# EAGLE design nokiaSuperBreakout (EAGLE 5.08)
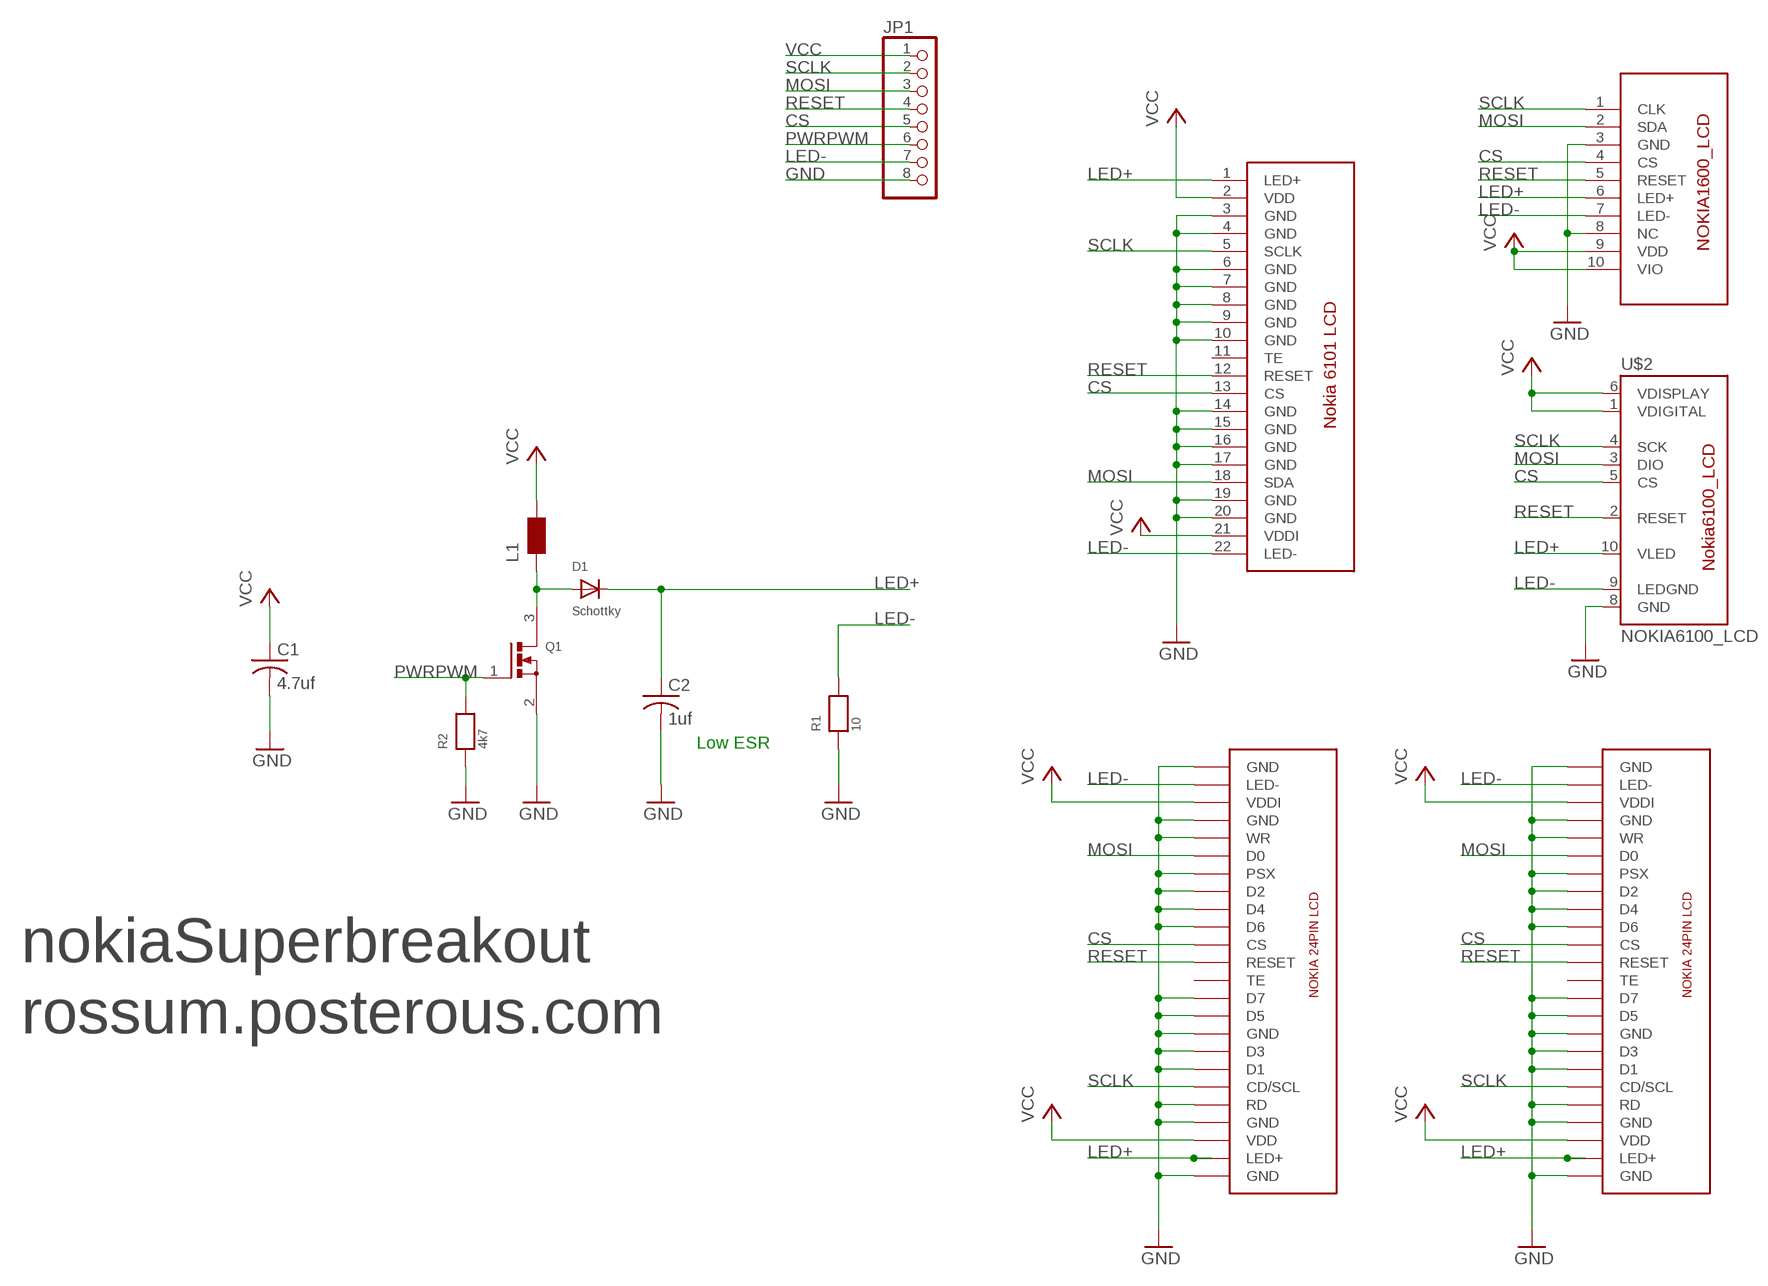
[diagram p0: schematic, sheet 1]

## Parts
C1  4.7uf  C-USC0805  [C0805]
C2  1uf  C-USC0805  [C0805]
D1  Schottky  DIODESOD-123  [SOD-123]
JP1  HEADER-1X8ROUND  [1X08_ROUND]
L1  WE-KIHQ_1008  [WE-KI_1008_B]
Q1  MOSFET-NREFLOW  [SOT23-R]
R1  10  RESISTOR0805  [0805]
R2  4k7  RESISTOR0805  [0805]
U$1  NOKIA1600_LCD  [NOKIA1600_LCD]
U$2  NOKIA6100_LCD  [NOKIA6100_LCD]
U$3  NOKIA6101_LCD  [NOKIA6101_LCD]
U$4  NOKIA24PIN_LCD  [FPC24_04MM]
U$5  NOKIA24PIN_LCD  [FPC24_04MM]

## Nets
CS: JP1.5 U$1.4(CS) U$2.5(CS) U$3.13(CS) U$4.P$11(CS) U$5.P$11(CS)
GND [power]: C1.2 C2.2 JP1.8 Q1.2(S) R1.1 R2.1 U$1.3(GND) U$1.8(NC) U$2.8(GND) U$3.3(GND) U$3.4(GND) U$3.6(GND) U$3.7(GND) U$3.8(GND) U$3.9(GND) U$3.10(GND) U$3.14(GND) U$3.15(GND) U$3.16(GND) U$3.17(GND) U$3.19(GND) U$3.20(GND) U$4.P$1(GND) U$4.P$4(GND) U$4.P$5(WR) U$4.P$7(PSX) U$4.P$8(D2) U$4.P$9(D4) U$4.P$10(D6) U$4.P$14(D7) U$4.P$15(D5) U$4.P$16(GND) U$4.P$17(D3) U$4.P$18(D1) U$4.P$20(RD) U$4.P$21(GND) U$4.P$24(GND) U$5.P$1(GND) U$5.P$4(GND) U$5.P$5(WR) U$5.P$7(PSX) U$5.P$8(D2) U$5.P$9(D4) U$5.P$10(D6) U$5.P$14(D7) U$5.P$15(D5) U$5.P$16(GND) U$5.P$17(D3) U$5.P$18(D1) U$5.P$20(RD) U$5.P$21(GND) U$5.P$24(GND)
LED+ [power]: C2.1 D1.C U$1.6(LED+) U$2.10(VLED) U$3.1(LED+) U$4.P$23(LED+) U$5.P$23(LED+)
LED-: JP1.7 R1.2 U$1.7(LED-) U$2.9(LEDGND) U$3.22(LED-) U$4.P$2(LED-) U$5.P$2(LED-)
MOSI: JP1.3 U$1.2(SDA) U$2.3(DIO) U$3.18(SDA) U$4.P$6(D0) U$5.P$6(D0)
N$6: D1.A L1.2 Q1.3(D)
PWRPWM: JP1.6 Q1.1(G) R2.2
RESET: JP1.4 U$1.5(RESET) U$2.2(RESET) U$3.12(RESET) U$4.P$12(RESET) U$5.P$12(RESET)
SCLK: JP1.2 U$1.1(CLK) U$2.4(SCK) U$3.5(SCLK) U$4.P$19(CD/SCL) U$5.P$19(CD/SCL)
VCC [power]: C1.1 JP1.1 L1.1 U$1.9(VDD) U$1.10(VIO) U$2.1(VDIGITAL) U$2.6(VDISPLAY) U$3.2(VDD) U$3.21(VDDI) U$4.P$3(VDDI) U$4.P$22(VDD) U$5.P$3(VDDI) U$5.P$22(VDD)
Unconnected: U$3.11(TE) U$4.P$13(TE) U$5.P$13(TE)

## Notes on the sheet
- Low ESR
- nokiaSuperbreakout
- rossum.posterous.com

## Library data of the parts
C1 C2 = adafruit:C-US: CAPACITOR, American symbol
D1 = microbuilder:DIODE: Diode SMADIODE - SMA Surface Mount Package 20V 1A Schottky Diode Digikey: 641-1014-6-ND SOD-123 30V 500mA (430mV Vf) Schottky Diode - Digikey: B0530W-FDICT-ND SOD-323 10V 570mA (380mV Vf, 3ns) Schottky Diode - Digikey: ZLLS410CT-ND SOD-523 30V 30mA Schottky Diode (RB751S-40TE61) - Digikey: RB751S-40TE61CT-ND SOT23-R/W - SOT23 Package (R = Solder Paste/Reflow Ovens, W = Hand-Soldering) BAT54Film 40V 300mA - Digikey: 497-7162-1-ND DO-1N4148 Through Hole Small Current Diode (any model)
JP1 = microbuilder:HEADER-1X8: PIN HEADER
L1 = PeterAtMega644:WE-KIHQ: SMD Wire Wound Ceramic Inductor WE-KIHQ - High current - Highest Quality factor in size 0805 - up to 98 - High thermal stability - High SRF -- Bluetooth -- Wireless LAN -- RF oscillation circuit -- IF impedance matching -- IG choke
Q1 = microbuilder:MOSFET-N: N-Channel Mosfet Digikey: 2N7002ET1GOSTR-ND
R1 R2 = microbuilder:RESISTOR: Resistors 0603 - 0603 Surface Mount Package 0 Ohm 1/10 Watt 1% Resistor 15 Ohm 1/10 Watt 1% Resistor 33 Ohm 1/10 Watt 1% Resistor 49.9 Ohm 1/10 Watt 1% Resistor 100 Ohm 1/10 Watt 1% Resistor 150 Ohm 1/10 Watt 1% Resistor 240 Ohm 1/10 Watt 1% Resistor 390 Ohm 1/10 Watt 1% Resistor 560 Ohm 1/10 Watt 1% Resistor 750 Ohm 1/10 Watt 1% Resistor 1.0K Ohm 1/10 Watt 1% Resistor 1.5K Ohm 1/10 Watt 1% Resistor 2.0K Ohm 1/10 Watt 1% Resistor 10.0K Ohm 1/10 Watt 1% Resistor 20.0K Ohm 1/10 Watt 1% Resistor 33.0K Ohm 1/10 Watt 1% Resistor 100.0K Ohm 1/10 Watt 1% Resistor 0805 - 0805 Surface Mount Package 0 Ohm 1/8 Watt 1% Resistor 33 Ohm 1/8 Watt 1% Resistor 100 Ohm 1/8 Watt 1% Resistor 150 Ohm 1/8 Watt 1% Resistor 200 Ohm 1/8 Watt 1% Resistor 240 Ohm 1/8 Watt 1% Resistor 330 Ohm 1/8 Watt 1% Resistor 390 Ohm 1/8 Watt 1% Resistor 470 Ohm 1/8 Watt 1% Resistor 1.0K Ohm 1/8 Watt 1% Resistor 1.5K Ohm 1/8 Watt 1% Resistor 2.0K Ohm 1/8 Watt 1% Resistor 4.7K Ohm 1/8 Watt 1% Resistor 5.1K Ohm 1/8 Watt 1% Resistor 5.6K Ohm 1/8 Watt 1% Resistor 10.0K Ohm 1/8 Watt 1% Resistor 22.0K Ohm 1/8 Watt 1% Resistor 33.0K Ohm 1/8 Watt 1% Resistor 100K Ohm 1/8 Watt 1% Resistor 1206 - 1206 Surface Mount Package
U$1 = PeterAtMega644:NOKIA1600_LCD
U$2 = PeterAtMega644:NOKIA6100_LCD: Nokia 6100 Color LCD Schematic element and footprint production proven but could use some touching up. Spark Fun Electronics SKU : LCD-00569. Mating SMD connector : LCD-00570
U$3 = PeterAtMega644:NOKIA6101_LCD: Serial Config for Nokia 6100 Display
U$4 U$5 = PeterAtMega644:NOKIA24PIN_LCD: 24 Pin Nokia Display as found in 3110/2630 etc

## Net classes
0 default: width 0.203 mm, drill 0.305 mm, clearance 0.152 mm
1 power: width 0.203 mm, drill 0.305 mm, clearance 0.152 mm

## Board
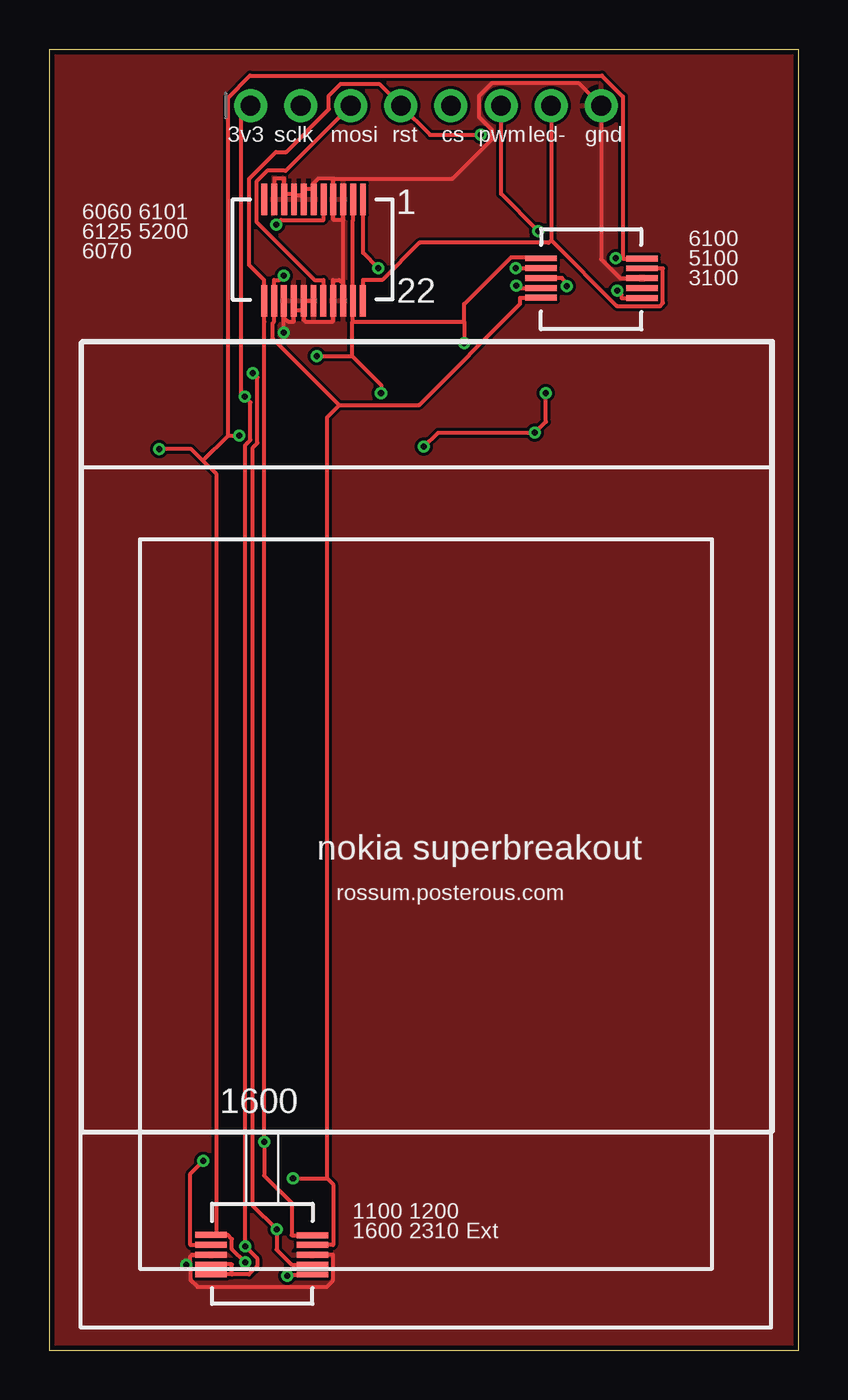
[diagram p1: board, top side]
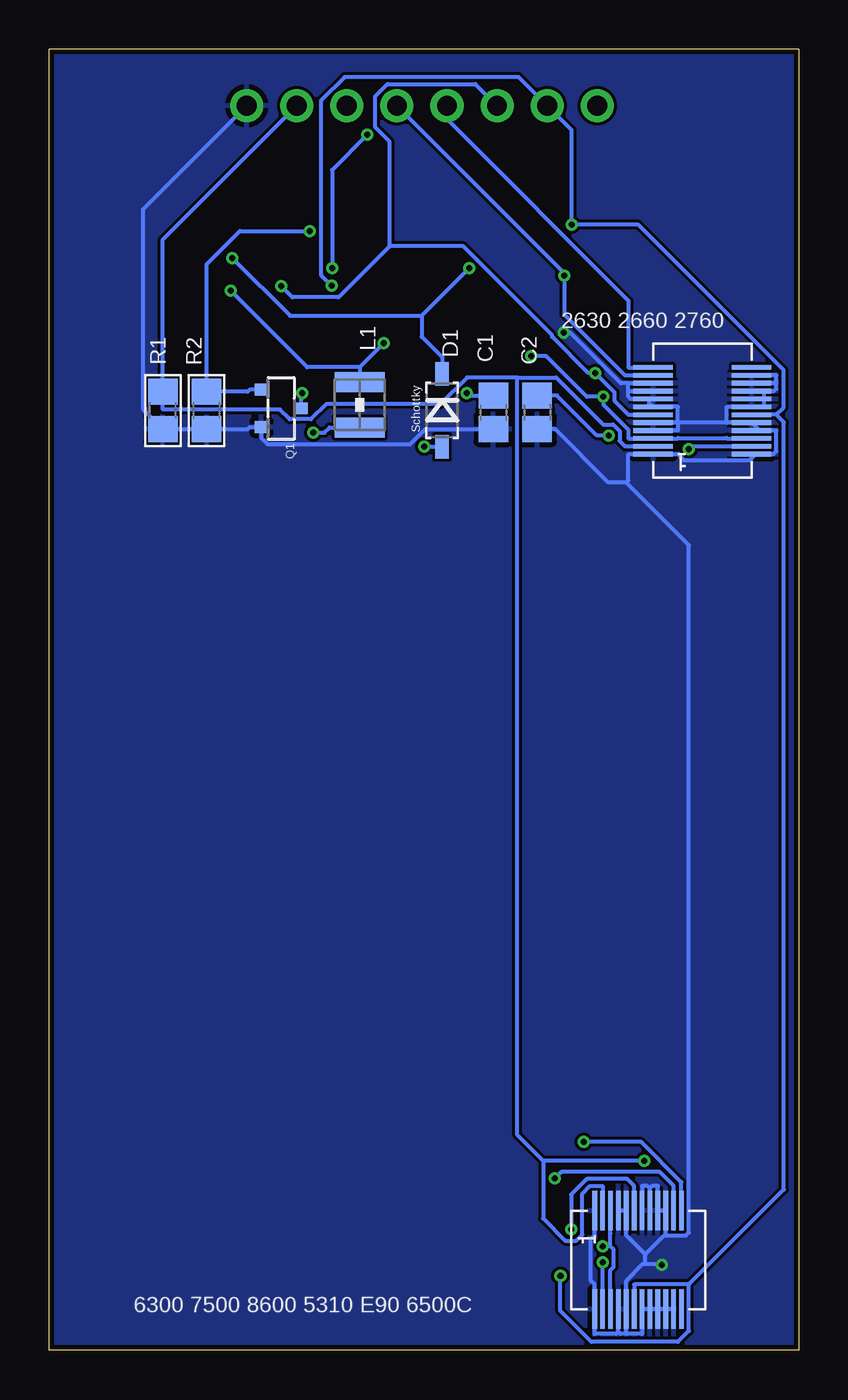
[diagram p2: board, bottom side, seen from below]

Size 38 x 66 mm. Coordinates in mm from the lower left corner, seen from the top.
Outline: 0,0 38,0 38,66 0,66 0,0
Copper layers (1*16): Top 0.035mm / dielectric 1.5mm / Bottom 0.035mm
Design rules "Fusion_eagle_rule_v1.1": minimum track width 6mil, minimum drill 12mil, track to track 6mil, track to pad 6mil, pad to pad 6mil, via to via 6mil, smd to smd 0mil, copper to edge 10mil, drill to drill 10mil, minimum pad ring 10mil, minimum via ring 6mil, stop-mask expansion 2mil, vias tented up to drill 100mil, thermal gap 10mil

### Footprints (pad centres in the part's own frame; a part is rotated, then mirrored left to right if it is on the bottom)
C0805 = smd 1.3 x 1.5: 1 -0.85,0; 2 0.85,0
SOD-123 = smd 1.2 x 0.7: A 1.85,0; C -1.85,0
1X08_ROUND = drill 1 pad 1.676 round: 1 -8.89,0; 2 -6.35,0; 3 -3.81,0; 4 -1.27,0; 5 1.27,0; 6 3.81,0; 7 6.35,0; 8 8.89,0
WE-KI_1008_B = smd 1.02 x 2.54: 1 -1.145,0; 2 1.145,0
SOT23-R = smd 0.6 x 0.7: 1 -0.95,-1; 2 0.95,-1; 3 0,1
0805 = smd 1.3 x 1.5: 1 -0.95,0; 2 0.95,0
NOKIA1600_LCD = smd 1.6 x 0.3: 1 23.255,40.961; 2 23.255,40.461; 3 23.255,39.961; 4 23.255,39.461; 5 23.255,38.961; 6 28.389,38.953; 7 28.389,39.453; 8 28.389,39.953; 9 28.389,40.453; 10 28.389,40.953
NOKIA6100_LCD = smd 1.6 x 0.3: 1 23.255,44.311; 2 23.255,43.811; 3 23.255,43.311; 4 23.255,42.811; 5 23.255,42.311; 6 28.389,42.303; 7 28.389,42.803; 8 28.389,43.303; 9 28.389,43.803; 10 28.389,44.303
NOKIA6101_LCD = smd 0.3 x 1.6: 1 14.311,57.245; 2 13.811,57.245; 3 13.311,57.245; 4 12.811,57.245; 5 12.311,57.245; 6 11.811,57.245; 7 11.311,57.245; 8 10.811,57.245; 9 10.311,57.245; 10 9.811,57.245; 11 9.311,57.245; 12 9.3,52.1; 13 9.8,52.1; 14 10.3,52.1; 15 10.8,52.1; 16 11.3,52.1; 17 11.8,52.1; 18 12.3,52.1; 19 12.8,52.1; 20 13.3,52.1; 21 13.8,52.1; 22 14.3,52.1
FPC24_04MM = smd 2 x 0.24: P$1 2.6,2; P$2 2.6,1.6; P$3 2.6,1.2; P$4 2.6,0.8; P$5 2.6,0.4; P$6 2.6,0; P$7 2.6,-0.4; P$8 2.6,-0.8; P$9 2.6,-1.2; P$10 2.6,-1.6; P$11 2.6,-2; P$12 2.6,-2.4; P$13 -2.4,-2.4; P$14 -2.4,-2; P$15 -2.4,-1.6; P$16 -2.4,-1.2; P$17 -2.4,-0.8; P$18 -2.4,-0.4; P$19 -2.4,0; P$20 -2.4,0.4; P$21 -2.4,0.8; P$22 -2.4,1.2; P$23 -2.4,1.6; P$24 -2.4,2

### Placement (x,y rotation side)
C1  15.48,47.58 270 bottom
C2  13.26,47.58 270 bottom
D1  18.08,47.68 270 bottom
JP1  19.1,63.14 0 top
L1  22.26,47.96 270 bottom
Q1  26.24,47.78 270 bottom
R1  32.24,47.68 90 bottom
R2  30.02,47.68 90 bottom
U$1  36.6,44.8 180 top
U$2  1.68,11.08 0 top
U$3  1.6,1.14 0 top
U$4  8.34,4.48 90 bottom
U$5  4.78,47.46 180 bottom

### Tracks (layer width: path | path; a pad name or v marks a point on that pad's centre or on a via)
CS  (via drill 0.3 pad 0.61)
  Top 0.203: v12.36,8.72 14.1,8.72 | 14.1,8.72 14.4,8.42 14.4,5.34 U$1.4 | 14.1,8.72 14.1,47.34 14.71,47.96 | 14.71,47.96 18.75,47.96 23.88,53.09 23.88,53.39 U$2.5 | 14.71,47.96 11.34,51.33 11.34,52.13 11.4,52.19 U$3.13 11.4,53.77 11.4,54.29 11.66,54.29 v11.88,54.51
  Bottom 0.203: U$4.P$11 6.34,8.33 7.05,9.05 12.03,9.05 v12.36,8.72 | JP1.5 11.88,54.65 v11.88,54.51 11.88,52.53 8.81,49.46 U$5.P$11
GND  (via drill 0.3 pad 0.61)
  Top 0.203: v6.95,4.34 7.16,4.34 | 7.16,4.34 7.16,3.58 7.52,3.22 14.07,3.22 14.4,3.55 14.4,4.84 U$1.3 | 7.16,4.34 7.16,4.76 7.25,4.85 U$1.8 | 14.41,59.44 20.45,59.44 22.46,61.44 22.46,61.9 21.82,62.54 21.82,63.65 22.46,64.3 26.84,64.3 JP1.8 27.99,55.35 28.96,54.38 29.02,54.38 U$2.8 | 12.9,52.76 12.9,52.27 12.99,52.19 14.4,52.19 U$3.19 14.4,54.29 14.7,54.29 14.9,54.1 | 12.9,52.76 U$3.16 U$3.17 | 12.4,52.76 12.4,52.19 12.1,52.19 11.9,52.38 | 12.4,52.76 U$3.15 | 12.4,52.76 12.9,52.76 | 11.9,52.38 11.9,53.02 U$3.14 | v11.9,51.61 11.9,52.19 11.9,52.38 | 14.9,54.1 14.9,53.5 U$3.20 | 14.9,57.33 14.41,57.33 U$3.4 14.41,59.35 14.41,59.44 | 14.9,57.33 14.91,57.33 U$3.3 | 14.9,57.33 14.9,54.29 14.9,54.1 | 12.41,58.58 12.35,58.65 11.91,58.65 | 12.41,58.58 12.41,58.52 U$3.8 | 12.91,58.58 12.91,58.91 13.41,58.91 | 12.91,58.58 U$3.7 | 12.91,58.58 12.41,58.58 | 14.41,59.44 13.65,59.44 13.41,59.2 13.41,58.91 | 13.41,58.91 U$3.6 | 11.91,58.65 11.91,58.91 11.91,59.24 11.91,59.44 11.41,59.44 U$3.10 | 11.91,58.65 U$3.9
  Bottom 0.203: 7.78,4.38 6.98,4.38 v6.95,4.34 | 7.78,4.38 7.89,4.38 8.74,3.53 U$4.P$20 8.74,0.83 | 7.78,4.38 7.78,4.86 | 7.78,4.86 8.74,5.83 U$4.P$5 U$4.P$4 | 6.74,5.83 | 6.74,5.83 6.81,5.83 7.78,4.86 | 8.75,44.03 5.57,40.84 5.57,5.97 5.71,5.83 6.74,5.83 | 2.18,45.46 2.48,45.16 5.82,45.16 6.13,45.46 U$5.P$1 8.63,45.46 8.63,44.14 8.75,44.03 | 7.58,48.26 7.58,48.06 U$5.P$7 6.13,47.86 6.13,47.06 | 7.58,48.26 8.01,48.26 8.52,48.26 8.63,48.38 8.63,48.66 | 8.63,48.66 U$5.P$9 | 7.58,48.26 U$5.P$8 | 6.13,47.06 6.98,47.06 U$5.P$5 | 6.13,47.06 6.13,46.66 U$5.P$4 | 3.63,47.06 6.13,47.06 | 1.98,46.66 U$5.P$20 3.63,47.06 | 1.98,46.66 U$5.P$21 | 1.98,46.66 1.75,46.66 1.13,46.66 1.13,45.61 1.28,45.46 2.18,45.46 | C1.2 18.93,46.73 19.7,45.96 26.93,45.96 27.24,46.28 Q1.2 27.54,46.83 27.84,46.83 27.94,46.73 R2.1 31.02,46.73 R1.1 33.26,47.75 33.26,57.87 JP1.8 | v11.9,51.61 11.57,51.61 9.02,49.06 8.63,49.06 | 8.74,0.83 7.94,0.83 U$4.P$18 U$4.P$17 U$4.P$16 U$4.P$15 U$4.P$14 | 9.14,0.94 9.02,0.83 8.74,0.83 | U$4.P$21 9.14,1.77 9.14,1.45 9.14,0.94 | 3.63,47.06 3.63,47.86 U$5.P$18 2.07,47.86 1.75,47.86 1.75,48.26 | U$4.P$1 10.34,5.83 10.54,5.63 10.54,3.53 10.34,3.33 U$4.P$24 10.34,0.83 9.26,0.83 9.14,0.94 | 8.75,44.03 9.64,44.03 12.35,46.73 C2.2 | 7.54,8.21 7.42,8.33 7.14,8.33 U$4.P$9 U$4.P$10 6.74,5.83 | 7.54,8.21 7.66,8.33 7.94,8.33 U$4.P$7 | 7.54,8.21 7.54,7.71 U$4.P$8 | 8.63,48.66 8.63,49.06 | 8.63,49.06 U$5.P$10 | 2.18,45.46 U$5.P$24 | U$5.P$17 2.07,48.26 1.75,48.26 | 1.75,48.66 1.25,48.66 1.13,48.78 1.13,49.06 1.25,49.06 | 1.75,48.66 1.98,48.66 U$5.P$16 | 1.75,48.26 1.75,48.66 | 1.25,49.06 1.98,49.06 U$5.P$15 | 1.25,49.06 1.13,49.18 1.13,49.46 U$5.P$14
  pour Top: 0.1,0 38,0 38,66 0,66 0,0
  pour Bottom: 0,66 38,66 38,0 0,0
LED+  (via drill 0.3 pad 0.61)
  Top 0.203: 7.79,45.13 8.48,44.44 8.48,5.85 | v5.57,45.72 7.21,45.72 7.79,45.13 | 7.79,45.13 9.07,46.41 | 29.08,55.41 29.08,63.6 28.02,64.66 10.18,64.66 9.07,63.55 9.07,46.41 | 9.07,46.41 v9.63,46.41 | 29.08,55.41 29.08,55.38 U$2.10 | 29.08,55.41 v28.72,55.41 | v16.69,54.9 15.91,55.68 U$3.1 | 8.48,5.85 8.74,5.85 9.05,5.85 9.27,5.63 9.27,5.13 v9.94,4.45 | 8.48,5.85 U$1.6
  Bottom 0.203: C2.1 12.26,48.43 10.23,46.41 v9.63,46.41 | U$5.P$23 5.42,45.86 v5.57,45.72 | 19.11,52.48 v16.69,54.9 | 19.11,52.48 19.11,51.42 18.08,50.38 D1.C | v28.72,55.41 25.79,52.48 19.11,52.48 | v9.94,4.45 U$4.P$23
LED-  (via drill 0.3 pad 0.61)
  Top 0.203: U$1.7 7.16,5.35 7.16,8.95 v7.82,9.61 | 25.45,56.31 28.78,52.98 30.98,52.98 31.12,53.13 31.12,54.88 U$2.9 | 25.45,56.31 25.32,56.18 18.77,56.18 16.88,54.29 15.9,54.29 U$3.22 | JP1.7 25.45,56.31
  Bottom 0.203: 14.26,49.35 12.3,49.35 9.91,46.96 9.4,46.96 9.07,46.64 9.07,46.13 8.81,45.86 8.63,45.86 U$5.P$2 | v7.82,9.61 12.96,9.61 | 12.96,9.61 12.96,6.69 11.82,5.55 11.28,5.55 10.97,5.86 10.97,7.95 10.58,8.33 9.94,8.33 U$4.P$2 | 12.96,9.61 14.26,10.92 14.26,49.35 | 14.26,49.35 16.81,49.35 18.17,48 23.96,48 24.73,47.23 25.81,47.23 26.31,47.73 32.24,47.73 R1.2 32.24,56.35 JP1.7
MOSI  (via drill 0.3 pad 0.61)
  Top 0.203: v10.32,49.58 10.55,49.35 10.55,46.03 10.32,45.8 10.32,7.33 v11.53,6.12 11.53,5.1 12.29,4.34 U$1.2 | v26.24,53.99 26.24,54.14 25.99,54.39 U$2.3 | U$3.18 13.9,54.29 13.46,54.29 10.5,57.26 10.5,59.28 11.05,59.83 11.98,59.83 JP1.3
  Bottom 0.203: 20.74,56.01 23.33,53.42 25.67,53.42 v26.24,53.99 | 20.74,56.01 17,56.01 12.49,51.5 12.49,51.41 10.66,49.58 v10.32,49.58 9.34,48.6 9.34,48.17 8.63,47.46 U$5.P$6 | JP1.3 16.39,64.24 20.85,64.24 21.47,63.62 21.47,62.04 20.74,61.3 20.74,56.01 | U$4.P$6 8.34,8.33 8.7,8.69 10.74,8.69 11.53,7.9 v11.53,6.12
N$6  (via drill 0.3 pad 0.61)
  Top 0.203: v25.18,48.55 25.18,47.11 v24.62,46.55 19.71,46.55 v19,45.83
  Bottom 0.203: Q1.3 25.24,48.33 25.18,48.4 v25.18,48.55 | D1.A 18.68,45.83 18.69,45.83 v19,45.83 | L1.2 23.78,46.81 24.05,46.55 v24.62,46.55
PWRPWM  (via drill 0.3 pad 0.61)
  Top 0.203: v24.8,56.78 22.91,58.67 JP1.6
  Bottom 0.203: v24.8,56.78 28.34,56.78 30.02,55.1 30.02,49.53 R2.2 27.94,48.63 27.84,48.73 Q1.1
RESET  (via drill 0.3 pad 0.61)
  Top 0.203: v21.88,61.66 19.31,61.66 JP1.4 16.73,64.25 14.77,64.25 14.18,63.65 14.18,62.96 12.01,60.79 11.5,60.79 10.14,59.43 10.14,55.05 10.9,54.29 U$3.12 10.9,52.19 10.9,52.18 v10.9,10.56 10.9,8.86 12.29,7.47 12.29,5.84 U$1.5 | v23.66,54.89 U$2.2
  Bottom 0.203: U$5.P$12 8.63,49.86 8.63,53.24 17.83,62.44 JP1.4 | U$4.P$12 5.94,8.53 7.98,10.56 v10.9,10.56 | v23.66,54.89 23.66,59.88 v21.88,61.66
SCLK  (via drill 0.3 pad 0.61)
  Top 0.203: v12.07,3.78 12.23,3.78 12.29,3.84 U$1.1 | v23.67,54 23.78,53.89 23.88,53.89 U$2.4 | U$3.5 13.91,57.33 11.74,57.33 v11.51,57.09
  Bottom 0.203: 5.57,3.33 | 5.57,3.33 5.57,0.97 6.12,0.42 10.5,0.42 12.07,1.99 v12.07,3.78 | 5.57,3.33 0.75,8.15 0.75,47.08 1.13,47.46 | 5.57,3.33 8.34,3.33 U$4.P$19 | 1.13,47.46 0.76,47.83 0.76,49.72 8.13,57.09 v11.51,57.09 11.51,61.9 JP1.2 14.2,64.59 23.02,64.59 24.22,63.39 24.22,54.55 v23.67,54 | 1.13,47.46 U$5.P$19
VCC  (via drill 0.3 pad 0.61)
  Top 0.203: 9.27,3.85 10.13,3.85 10.54,4.26 10.54,4.67 v9.94,5.27 9.94,45.92 10.19,46.17 10.19,48.08 v9.9,48.37 9.74,48.53 9.74,62.67 JP1.1 | 15.36,50.43 15.36,52.15 15.4,52.19 | v16.82,48.55 16.82,48.97 15.36,50.43 | v13.56,50.43 15.36,50.43 | 15.4,52.19 21.04,52.19 | 21.04,52.19 v21.04,51.09 | 9.27,3.85 9.27,4.35 U$1.9 | 9.27,3.85 U$1.10 | U$2.1 24.88,55.45 23.42,55.45 21.04,53.07 21.04,52.19 | U$2.6 29.02,53.38 29.02,53.54 v28.81,53.75 | 15.4,52.19 U$3.21 15.4,57.32 15.41,57.33 U$3.2
  Bottom 0.203: U$5.P$22 3.63,46.26 3.65,46.28 6.11,46.28 6.13,46.26 U$5.P$3 8.63,46.26 8.63,46.7 9.9,47.97 v9.9,48.37 10.74,48.37 12.8,50.43 v13.56,50.43 | 9.54,5.27 9.54,5.92 U$4.P$3 | U$4.P$22 9.54,4.06 9.38,4.22 9.38,5.11 9.54,5.27 | 9.54,5.27 v9.94,5.27 | C1.1 16.7,48.43 v16.82,48.55 | v21.04,51.09 22.26,49.87 | 22.26,49.87 L1.1 | 22.26,49.87 24.93,49.87 v28.81,53.75

### Text on the board
tPlace: 6060 6101 | 6125 5200 | 6100 | 6070 | 5100 | 3100 | 1100 1200 | 1600 2310 Ext
bPlace: 2630 2660 2760 | 6300 7500 8600 5310 E90 6500C
tNames: 3v3 | sclk | mosi | rst | cs | pwm | led- | gnd | nokia superbreakout | rossum.posterous.com